# Altium schematic sheet uController.SchDoc
size A
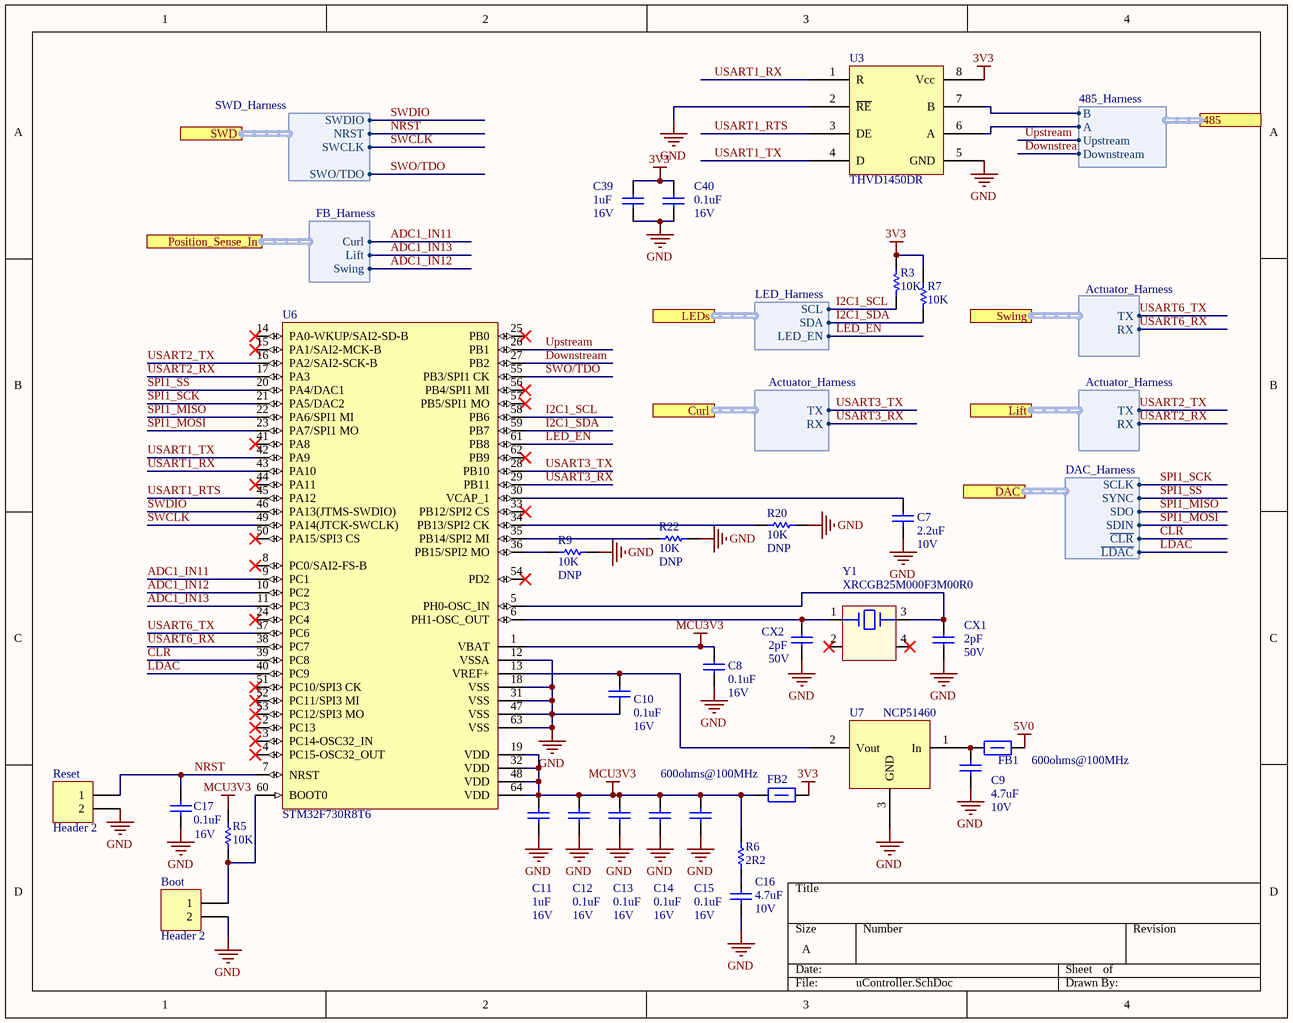
[diagram p0: uController.SchDoc]

## Parts
Boot  Header 2  [HDR1X2]
C7  2.2uF  Voltage - Rated: 10V  [CAPC1005(0402)N]
C8  0.1uF  Voltage - Rated: 16V  [CAPC1005(0402)N]
C9  4.7uF  Voltage - Rated: 10V  [CAPC1005(0402)N]
C10  0.1uF  Voltage - Rated: 16V  [CAPC1005(0402)N]
C11  1uF  Voltage - Rated: 16V  [CAPC1005(0402)N]
C12  0.1uF  Voltage - Rated: 16V  [CAPC1005(0402)N]
C13  0.1uF  Voltage - Rated: 16V  [CAPC1005(0402)N]
C14  0.1uF  Voltage - Rated: 16V  [CAPC1005(0402)N]
C15  0.1uF  Voltage - Rated: 16V  [CAPC1005(0402)N]
C16  4.7uF  Voltage - Rated: 10V  [CAPC1005(0402)N]
C17  0.1uF  Voltage - Rated: 16V  [CAPC1005(0402)N]
C39  1uF  Voltage - Rated: 16V  [CAPC1005(0402)N]
C40  0.1uF  Voltage - Rated: 16V  [CAPC1005(0402)N]
CX1  2pF  Voltage - Rated: 50V  [CAPC1005(0402)N]
CX2  2pF  Voltage - Rated: 50V  [CAPC1005(0402)N]
FB1  600ohms@100MHz  [INDC1608X100N]
FB2  600ohms@100MHz  [INDC1608X100N]
R3  10K  [RESC1005(0402)N]
R5  10K  [RESC1005(0402)N]
R6  2R2  [RESC1005(0402)N]
R7  10K  [RESC1005(0402)N]
R9  value 10K  [0402]  (hidden comment: Res1)
R20  value 10K  [0402]  (hidden comment: Res1)
R22  value 10K  [0402]  (hidden comment: Res1)
Reset  Header 2  [HDR1X2]
U3  THVD1450DR  [SOIC8]
U6  STM32F730R8T6  [STM-LQFP64_V]
U7  NCP51460  [SOT95P237X111-3N]
Y1  XRCGB25M000F3M00R0  [XTAL2x1.6-XRCGB]

## Ports
485 (harness 485_Harness), Curl (harness Actuator_Harness), DAC (harness DAC_Harness), LEDs (harness LED_Harness), Lift (harness Actuator_Harness), Position_Sense_In (harness FB_Harness), SWD (harness SWD_Harness), Swing (harness Actuator_Harness)

## Harnesses
SWD_Harness: NRST, SWDIO, SWCLK, SWO/TDO
485_Harness: A, B, Upstream, Downstream
Actuator_Harness: RX, TX
LED_Harness: SDA, SCL, LED_EN
FB_Harness: Lift, Curl, Swing
DAC_Harness: SDIN, SDO, SCLK, SYNC, ~{CLR}, ~{LDAC}

## Nets
3V3: C39.2 C40.2 FB2.2 R3.2 R7.2 U3.8(Vcc)
5V0: FB1.2
GND: Boot.2 C7.1 C8.1 C9.1 C10.1 C11.1 C12.1 C13.1 C14.1 C15.1 C16.1 C17.1 C39.1 C40.1 CX1.1 CX2.1 R9.2 R20.2 R22.2 Reset.2 U3.2(~{RE}) U3.5(GND) U6.12(VSSA) U6.18(VSS) U6.31(VSS) U6.47(VSS) U6.63(VSS) U7.3(GND)
MCU3V3: C8.2 C11.2 C12.2 C13.2 C14.2 C15.2 FB2.1 R5.2 R6.2 U6.1(VBAT) U6.19(VDD) U6.32(VDD) U6.48(VDD) U6.64(VDD)
ADC1_IN11: U6.9(PC1) ; port Position_Sense_In.Curl
ADC1_IN12: U6.10(PC2) ; port Position_Sense_In.Swing
ADC1_IN13: U6.11(PC3) ; port Position_Sense_In.Lift
~{CLR}: U6.39(PC8) ; port DAC.~{CLR}
Downstream: U6.27(PB2) ; port 485.Downstream
I2C1_SCL: R3.1 U6.58(PB6) ; port LEDs.SCL
I2C1_SDA: R7.1 U6.59(PB7) ; port LEDs.SDA
~{LDAC}: U6.40(PC9) ; port DAC.~{LDAC}
LED_EN: U6.61(PB8) ; port LEDs.LED_EN
NRST: C17.2 Reset.1 U6.7(NRST) ; port SWD.NRST
SPI1_MISO: U6.22(PA6/SPI1_MI) ; port DAC.SDO
SPI1_MOSI: U6.23(PA7/SPI1_MO) ; port DAC.SDIN
SPI1_~{SS}: U6.20(PA4/DAC1) ; port DAC.SYNC
SPI1_SCK: U6.21(PA5/DAC2) ; port DAC.SCLK
SWCLK: U6.49(PA14(JTCK-SWCLK)) ; port SWD.SWCLK
SWDIO: U6.46(PA13(JTMS-SWDIO)) ; port SWD.SWDIO
SWO/TDO: U6.55(PB3/SPI1_CK) ; port SWD.SWO/TDO
Upstream: U6.26(PB1) ; port 485.Upstream
USART1_RTS: U3.3(DE) U6.45(PA12)
USART1_RX: U3.1(R) U6.43(PA10)
USART1_TX: U3.4(D) U6.42(PA9)
USART2_RX: U6.17(PA3) ; port Lift.RX
USART2_TX: U6.16(PA2/SAI2-SCK-B) ; port Lift.TX
USART3_RX: U6.29(PB11) ; port Curl.RX
USART3_TX: U6.28(PB10) ; port Curl.TX
USART6_RX: U6.38(PC7) ; port Swing.RX
USART6_TX: U6.37(PC6) ; port Swing.TX
NetBoot_1: Boot.1 R5.1 U6.60(BOOT0)
NetC7_2: C7.2 U6.30(VCAP_1)
NetC9_2: C9.2 FB1.1 U7.1(In)
NetC10_2: C10.2 U6.13(VREF+) U7.2(Vout)
NetC16_2: C16.2 R6.1
NetCX1_2: CX1.2 U6.5(PH0-OSC_IN) Y1.3(X3)
NetCX2_2: CX2.2 U6.6(PH1-OSC_OUT) Y1.1(X1)
NetR9_1: R9.1 U6.36(PB15/SPI2_MO)
NetR20_1: R20.1 U6.34(PB13/SPI2_CK)
NetR22_1: R22.1 U6.35(PB14/SPI2_MI)
NetU3_6: U3.6(A) ; port 485.A
NetU3_7: U3.7(B) ; port 485.B

Not connected (* = marked no-connect by the designer): U6 2(PC13)* 3(PC14-OSC32_IN)* 4(PC15-OSC32_OUT)* 8(PC0/SAI2-FS-B)* 14(PA0-WKUP/SAI2-SD-B)* 15(PA1/SAI2-MCK-B)* 24(PC4)* 25(PB0)* 33(PB12/SPI2_CS)* 41(PA8)* 44(PA11)* 50(PA15/SPI3_CS)* 51(PC10/SPI3_CK)* 52(PC11/SPI3_MI)* 53(PC12/SPI3_MO)* 54(PD2)* 56(PB4/SPI1_MI)* 57(PB5/SPI1_MO)* 62(PB9)*; Y1 2(GND)* 4(GND)*

## Library data of the parts
Boot Reset = Header 2: Header, 2-Pin; LatestRevisionDate: 17-Jul-2002; LatestRevisionNote: Re-released for DXP Platform.; Publisher: Altium Limited; DNP: DNP
C7 = CAP: Manufacturer 1: Murata; Manufacturer Part Number 1: GRM155R61A225KE95D; Temperature Coefficient: X5R; Tolerance: ±10%; Level: 1; Vendor PN: 490-10451-1-ND; RoHS: RoHS Compliant; Category: Capacitors; Capacitance: 2.2uF; Mounting Type: Surface Mount, MLCC; Operating Temperature: -55°C ~ 85°C; Package / Case: 0402 (1005 Metric); Size / Dimension: 0.039" L x 0.020" W (1.00mm x 0.50mm); Thickness (Max): 0.022" (0.55mm)
C8 = CAP: Manufacturer 1: Murata; Manufacturer Part Number 1: GRM155R61C104KA88D; Temperature Coefficient: X5R; Tolerance: ±10%; Level: 1; Vendor PN: 490-5415-1-ND; RoHS: RoHS Compliant; Category: Capacitors; Capacitance: 0.1uF; Mounting Type: Surface Mount, MLCC; Operating Temperature: -55°C ~ 85°C; Package / Case: 0402 (1005 Metric); Size / Dimension: 0.039" L x 0.020" W (1.00mm x 0.50mm); Thickness (Max): 0.022" (0.55mm)
C9 C16 = CAP: Manufacturer 1: Murata; Manufacturer Part Number 1: GRM155R61A475MEAAD; Temperature Coefficient: X5R; Tolerance: ±10%; Level: 1; Vendor PN: 490-14306-1-ND; RoHS: RoHS Compliant; Category: Capacitors; Capacitance: 4.7uF; Mounting Type: Surface Mount, MLCC; Operating Temperature: -55°C ~ 85°C; Package / Case: 0402 (1005 Metric); Size / Dimension: 0.039" L x 0.020" W (1.00mm x 0.50mm); Thickness (Max): 0.022" (0.55mm)
C10 C12-C15 C17 C40 = CAP: CAP CER 0.1UF 16V X5R 0402; Manufacturer 1: Murata; Manufacturer Part Number 1: GRM155R61C104KA88D; Tolerance: ±10%; Level: 1; Vendor PN: 490-5415-1-ND; Temperature Coefficient: X5R; RoHS: RoHS Compliant; Category: Capacitors; Capacitance: 0.1uF; Mounting Type: Surface Mount, MLCC; Operating Temperature: -55°C ~ 85°C; Package / Case: 0402 (1005 Metric); Size / Dimension: 0.039" L x 0.020" W (1.00mm x 0.50mm); Thickness (Max): 0.022" (0.55mm)
C11 C39 = CAP: Manufacturer 1: Samsung; Manufacturer Part Number 1: CL05A105KO5NNNC; Tolerance: ±10%; Level: 1; Vendor PN: 1276-1067-1-ND; RoHS: RoHS Compliant; Category: Capacitors; Capacitance: 1uF; Mounting Type: Surface Mount, MLCC; Operating Temperature: -55°C ~ 85°C; Package / Case: 0402 (1005 Metric); Size / Dimension: 0.039" L x 0.020" W (1.00mm x 0.50mm); Thickness (Max): 0.022" (0.55mm)
CX1 CX2 = CAP: CAP C0G/NP0; Manufacturer 1: Yageo; Manufacturer Part Number 1: CC0402CRNPO9BN2R0; Temperature Coefficient: X5R; Tolerance: ±10%; Level: 1; Vendor PN: 311-1006-1-ND; RoHS: RoHS Compliant; Category: Capacitors; Capacitance: 2pF; Mounting Type: Surface Mount, MLCC; Operating Temperature: -55°C ~ 85°C; Package / Case: 0402 (1005 Metric); Size / Dimension: 0.039" L x 0.020" W (1.00mm x 0.50mm); Thickness (Max): 0.022" (0.55mm)
FB1 FB2 = IND-FERRITE: Inductor, ferrite bead, 1608; Manufacturer 1: Murata; Manufacturer Part Number 1: BLM18KG601SN1D; Tolerance: 20%; DC Resistance (DCR): 150mR; Max DC Current: 1.3A; Test Frequency: 100MHz; Vendor PN: 490-5258-1-ND; Case/Package: 0603; Case Code (Metric): 1608; Impedance: 600ohms@100MHz; Termination: SMD/SMT; Composition: ferrite; Lead Free: Lead Free; Category: inductors; Package / Case: 0603 (1608 Metric)
R3 R5 R7 = RES: Resistor, Chip; Manufacturer 1: Stackpole; Manufacturer Part Number 1: RMCF0402FT10K0; Level: 1; Vendor PN: RMCF0402FT10K0CT-ND; Category: Resistors; Number of Terminations: 2; Composition: -; Power (Watts): -; Resistance: 10K; Temperature Coefficient: -; Tolerance: -; Package / Case: 0402 (1005 Metric)
R6 = RES: Resistor, Chip; Manufacturer 1: Stackpole; Manufacturer Part Number 1: RMCF0402FT2R20; Level: 1; Vendor PN: RMCF0402FT2R20CT-ND; Category: Resistors; Number of Terminations: 2; Composition: -; Power (Watts): -; Resistance: 2R2; Temperature Coefficient: -; Tolerance: -; Package / Case: 0402 (1005 Metric)
R9 R20 R22 = Res1: Resistor; Vendor PN: RMCF0402FT10K0CT-ND; Published: 8-Jun-2000; LatestRevisionDate: 17-Jul-2002; LatestRevisionNote: Re-released for DXP Platform.; PackageReference: AXIAL-0.3; Publisher: Altium Limited; PackageDescription: Axial Device, Thru-Hole; 2 Leads; 0.3 in Pin Spacing; DNP: DNP
U3 = THVD1450DR: Vendor PN: 296-50395-1-ND
U6 = STM32F730R8T6: IC, Cortex-M7 32b MCU+FPU, 462DMIPS, 64KB Flash / /256+16+4KB RAM, 64 pin LQFP; Manufacturer 1: STMicro; Vendor PN: 497-18103-ND; Manufacturer Part Number 1: STM32F730R8T6; Category: ICs
U7 = NCP51460: Vendor PN: NCP51460SN33T1GOSCT-ND
Y1 = XTAL01: Crystal, Murata  XRCGB25M000F3M00R0; Value: 25MHz; Vendor Pn: 490-5578-1-ND; Manufacturer 1: Murata; Manufacturer Part Number 1: XRCGB25M000F3M00R0; Category: frequency control